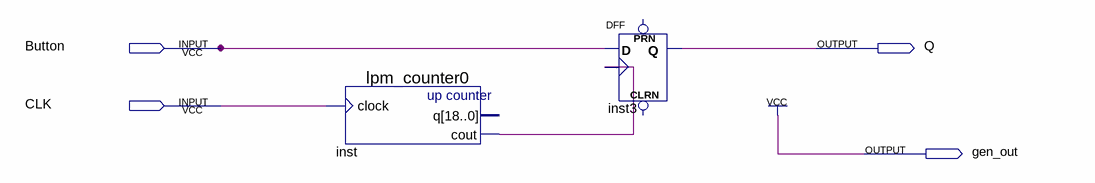
[diagram p0: schematic sheet]
// Quartus schematic Antitinkling.bdf as structural Verilog: 2 symbols, 4 pins
module Antitinkling (
  input  Button,
  input  CLK,
  output Q,
  output gen_out
);

  wire inst_cout;

  lpm_counter0 inst (.clock(CLK), .cout(inst_cout));  // open: q
  DFF inst3 (.CLK(inst_cout), .D(Button), .Q(Q));  // open: CLRN, PRN

  assign gen_out = 1'b1;
endmodule
